# EAGLE design eurorack-passive-jfet (EAGLE 9.6.2)
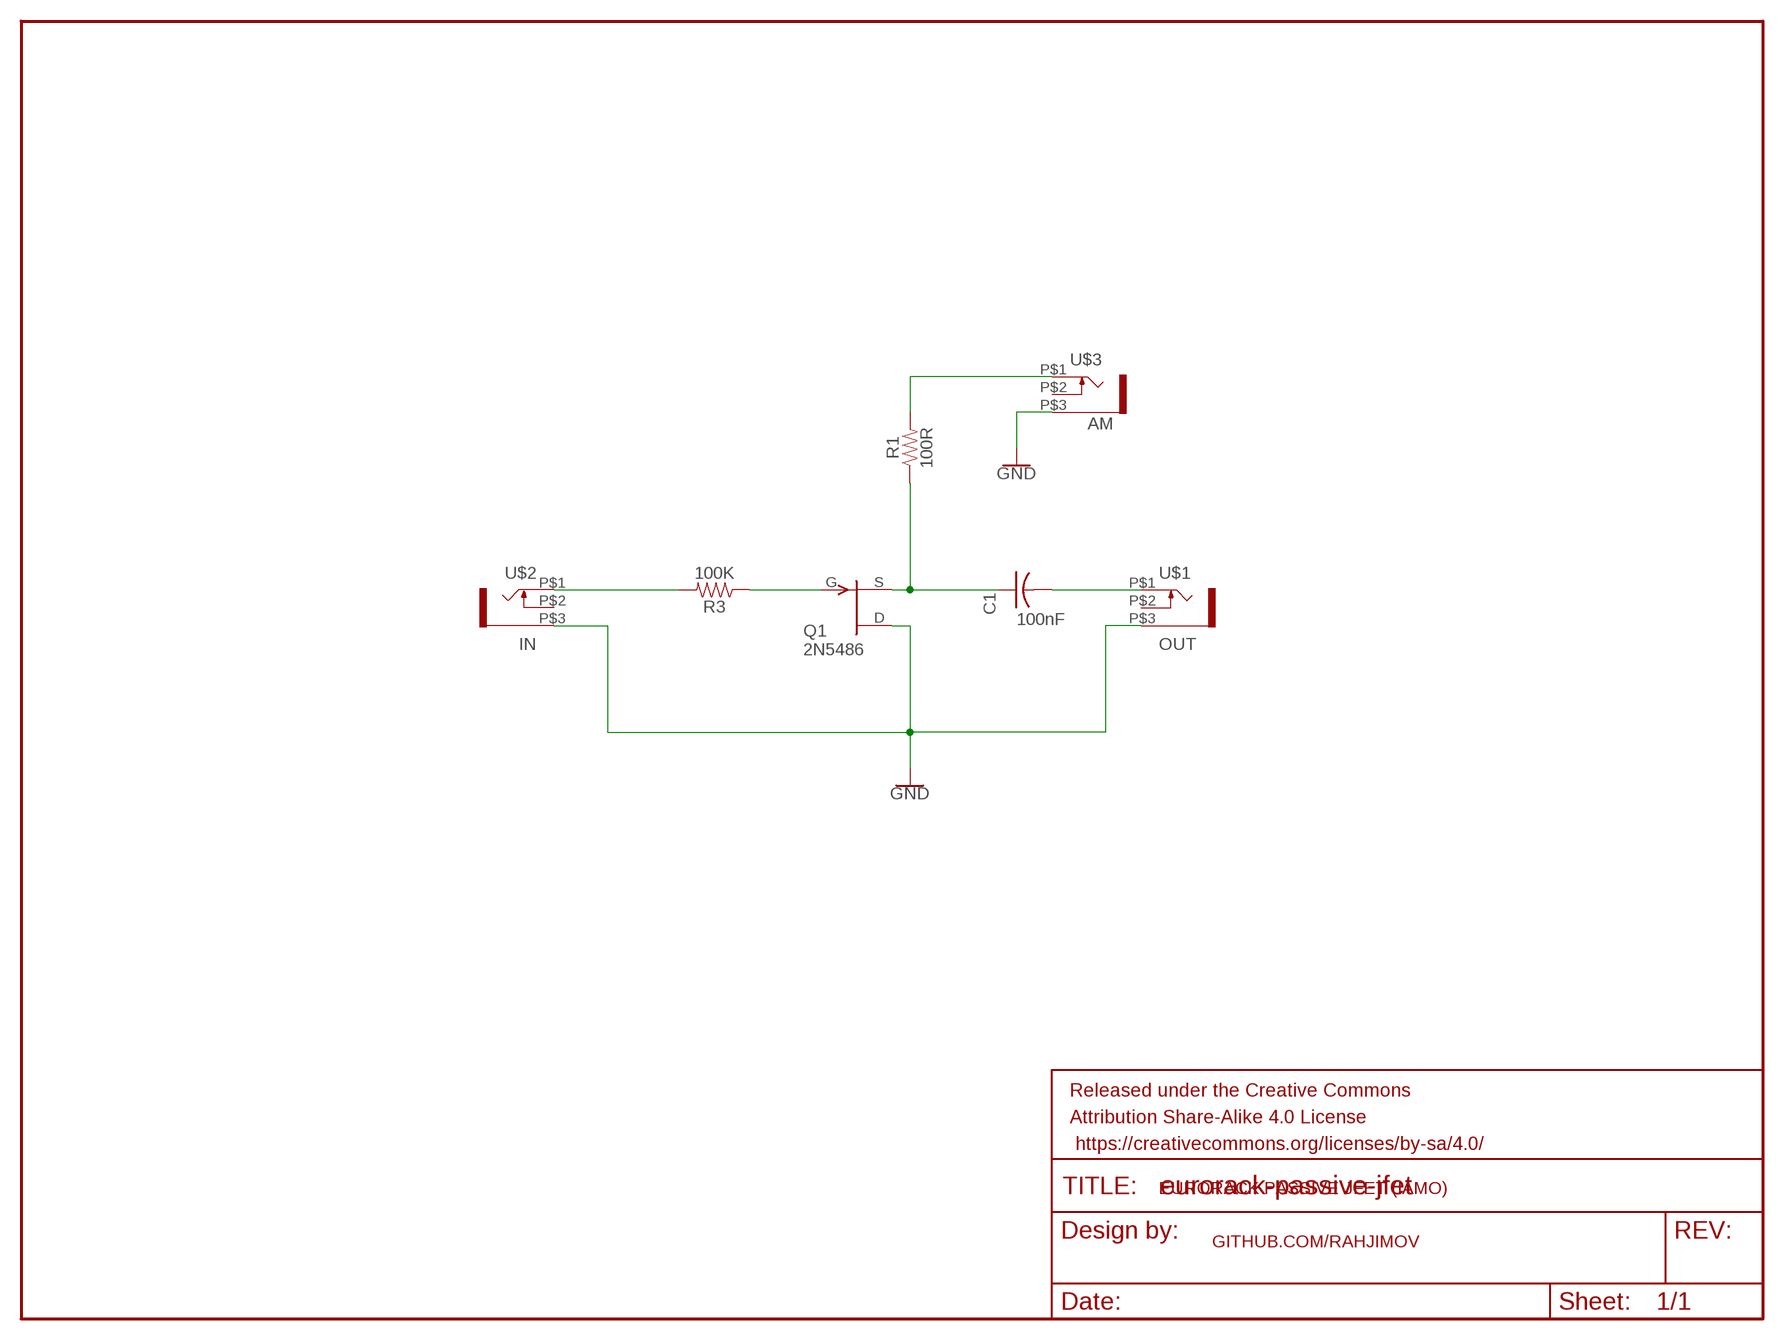
[diagram p0: schematic, sheet 1]

## Parts
C1  100nF  C-US025-025X050  [C025-025X050]
FRAME1  FRAME-LETTERNO_PACKAGE  [DUMMY]
Q1  2N5486  [TO92-]
R1  100R  330OHM-HORIZ-1/10W-5%  [AXIAL-0.3]
R3  100K  330OHM-HORIZ-1/10W-5%  [AXIAL-0.3]
U$1  OUT  WQP-PJ301M-12_JACK  [WQP-PJ301M-12_JACK]
U$2  IN  WQP-PJ301M-12_JACK  [WQP-PJ301M-12_JACK]
U$3  OUT  WQP-PJ301M-12_JACK  [WQP-PJ301M-12_JACK]

## Nets
GND: Q1.3(D) U$1.P$3 U$2.P$3 U$3.P$3
N$1: R1.P$2 U$3.P$1
N$2: C1.1 Q1.2(S) R1.P$1
N$3: C1.2 U$1.P$1
N$5: R3.P$2 U$2.P$1
N$6: Q1.1(G) R3.P$1
Unconnected: U$1.P$2 U$2.P$2 U$3.P$2

## Notes on the sheet
- AM
- 100nF
- EURORACK PASSIVE JFET (IAMO)
- GITHUB.COM/RAHJIMOV

## Library data of the parts
C1 = adafruit:C-US: CAPACITOR, American symbol
FRAME1 = SparkFun-Aesthetics:FRAME-LETTER: Schematic Frame - Letter Standard 8.5x11 US Letter frame; DESIGNER: Nobody; VERSION: v01
Q1 = transistor-fet:?548*: N-Channel JFETs Source: VISHAY 2N5484.pdf Compatible: TO92 2N5245 J304 J305 U310 J308 J309 J310 TO72 2N4416 2N4416A 2N3823 2N4351 3N169 3N170 3N171 MFE3002 TO18 2N3796 2N3797 MFE825 Source: Motorola European Master Guide Pacge 3-59
R1 R3 = SparkFun-Resistors:330OHM: 330Ω resistor A resistor is a passive two-terminal electrical component that implements electrical resistance as a circuit element. Resistors act to reduce current flow, and, at the same time, act to lower voltage levels within circuits. - Wikipedia; PROD_ID: RES-8371; VALUE: 330
U$1-U$3 = thonkiconn:WQP-PJ301M-12_JACK

## Board
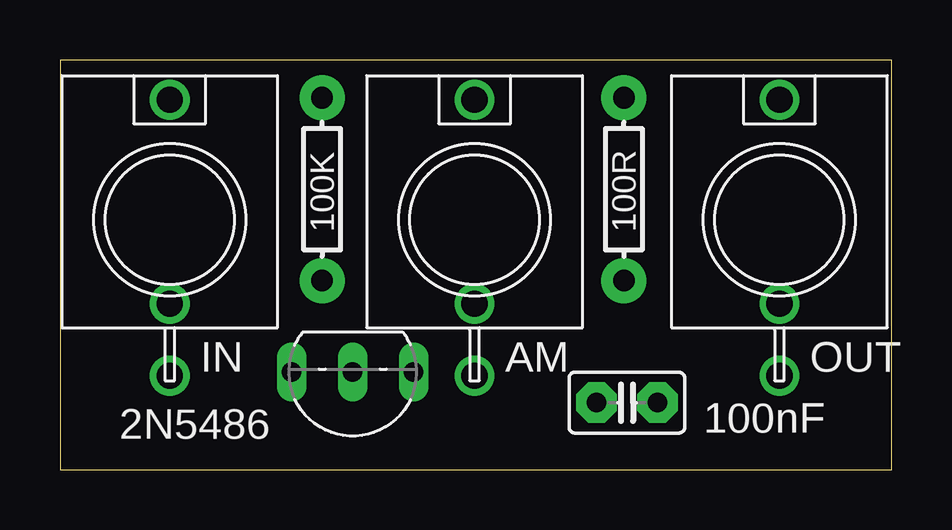
[diagram p1: board, top side]
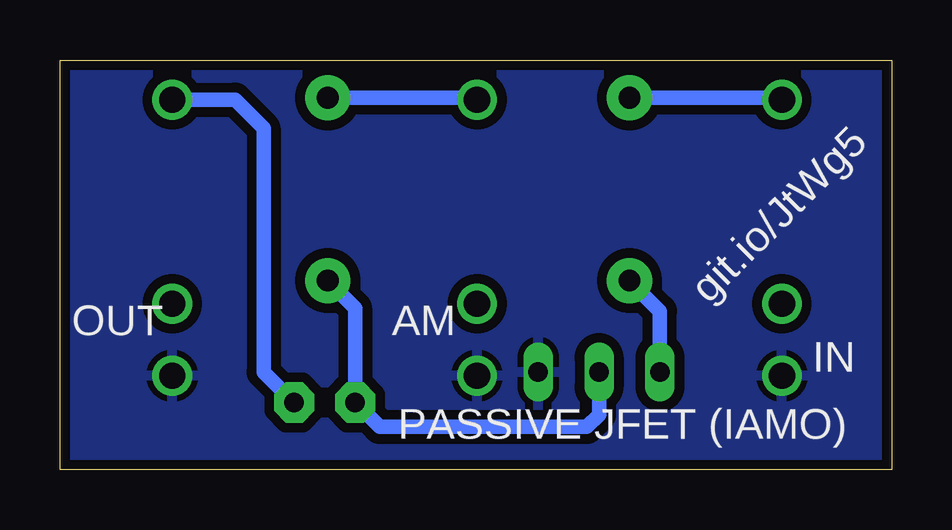
[diagram p2: board, bottom side, seen from below]

Size 34.65 x 17.07 mm. Coordinates in mm from the lower left corner, seen from the top.
Outline: 0,0 34.65,0 34.65,17.07 0,17.07 0,0
Copper layers (1*16): Top 0.0356mm / dielectric 1.5011mm / Bottom 0.0356mm
Design rules "oshpark-2layer": minimum track width 6mil, minimum drill 13mil, track to track 6mil, track to pad 6mil, pad to pad 6mil, via to via 6mil, smd to smd 6mil, copper to edge 15mil, drill to drill 6mil, minimum pad ring 7mil, minimum via ring 7mil, stop-mask expansion 2.5mil, vias tented up to drill 0mil, thermal gap 10mil

### Footprints (pad centres in the part's own frame; a part is rotated, then mirrored left to right if it is on the bottom)
C025-025X050 = drill 0.813 pad 1.676 octagon: 1 -1.27,0; 2 1.27,0
TO92- = drill 0.813 long: 1 2.54,0; 2 0,0; 3 -2.54,0
AXIAL-0.3 = drill 0.9 pad 1.88: P$1 -3.81,0; P$2 3.81,0
WQP-PJ301M-12_JACK = drill 1.1: P$1 0,5; P$2 0,-3.5; P$3 0,-6.5

### Placement (x,y rotation side)
C1  23.62,2.79 0 top
FRAME1  0,0.51 0 top
Q1  12.19,4.06 180 top
R1  23.5,11.68 90 top
R3  10.92,11.68 90 top
U$1  29.97,10.41 0 top
U$2  4.57,10.41 0 top
U$3  17.27,10.41 0 top

### Tracks (layer width: path | path; a pad name or v marks a point on that pad's centre or on a via)
GND
  pour Bottom (isolate 0.406): -1.78,18.03 36.32,18.03 36.32,-1.02 -1.78,-1.02
N$1
  Bottom 0.61: U$3.P$1 17.35,15.49 R1.P$2
N$2
  Bottom 0.61: R1.P$1 22.35,6.73 C1.1 21.34,1.78 12.7,1.78 12.19,2.29 Q1.2
N$3
  Bottom 0.61: U$1.P$1 27.35,15.41 26.16,14.22 26.16,4.06 C1.2
N$5
  Bottom 0.61: U$2.P$1 4.65,15.49 R3.P$2
N$6
  Bottom 0.61: Q1.1 9.65,6.6 R3.P$1

### Text on the board
tNames: 100K | 100R | IN | AM | OUT | 100nF
bNames: git.io/JtWg5 | AM | OUT | IN | PASSIVE JFET (IAMO)